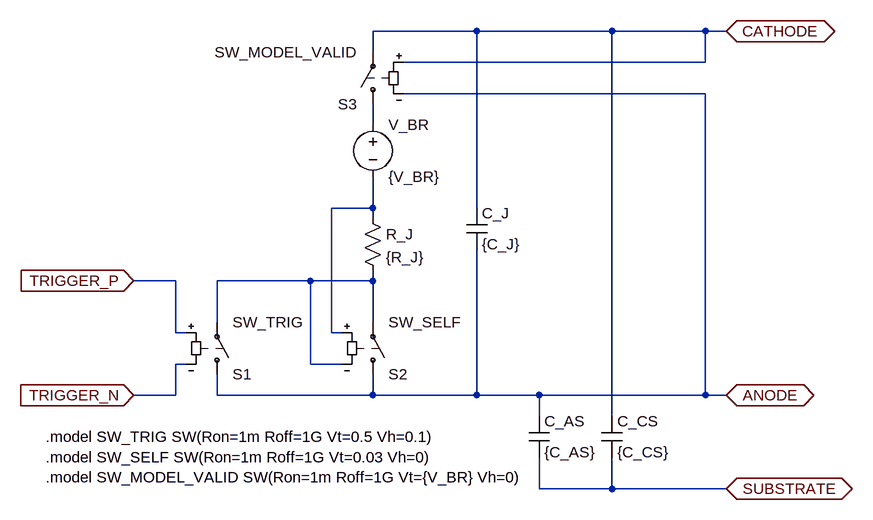
[diagram p0: schematic SPAD_model.asc]
SPAD_model.asc, the LTspice schematic file:
Version 4
SHEET 1 960 680
WIRE -448 -112 -608 -112
WIRE -240 -112 -448 -112
WIRE -96 -112 -240 -112
WIRE -64 -112 -96 -112
WIRE -608 -80 -608 -112
WIRE -96 -64 -96 -112
WIRE -96 -64 -560 -64
WIRE -96 -16 -560 -16
WIRE -608 32 -608 0
WIRE -608 160 -608 112
WIRE -608 160 -672 160
WIRE -448 160 -448 -112
WIRE -608 176 -608 160
WIRE -912 272 -976 272
WIRE -704 272 -848 272
WIRE -608 272 -608 256
WIRE -608 272 -704 272
WIRE -848 336 -848 272
WIRE -608 336 -608 272
WIRE -912 352 -912 272
WIRE -896 352 -912 352
WIRE -672 352 -672 160
WIRE -656 352 -672 352
WIRE -896 400 -912 400
WIRE -704 400 -704 272
WIRE -656 400 -704 400
WIRE -912 448 -912 400
WIRE -912 448 -976 448
WIRE -848 448 -848 416
WIRE -608 448 -608 416
WIRE -608 448 -848 448
WIRE -448 448 -448 224
WIRE -448 448 -608 448
WIRE -352 448 -448 448
WIRE -96 448 -96 -16
WIRE -96 448 -352 448
WIRE -64 448 -96 448
WIRE -352 480 -352 448
WIRE -240 480 -240 -112
WIRE -352 592 -352 544
WIRE -240 592 -240 544
WIRE -240 592 -352 592
WIRE -64 592 -240 592
FLAG -976 272 TRIGGER_P
IOPIN -976 272 In
FLAG -976 448 TRIGGER_N
IOPIN -976 448 In
FLAG -64 448 ANODE
IOPIN -64 448 BiDir
FLAG -64 -112 CATHODE
IOPIN -64 -112 BiDir
FLAG -64 592 SUBSTRATE
IOPIN -64 592 BiDir
SYMBOL voltage -608 16 R0
WINDOW 123 0 0 Left 2
WINDOW 39 0 0 Left 2
SYMATTR InstName V_BR
SYMATTR Value {V_BR}
SYMBOL res -624 160 R0
SYMATTR InstName R_J
SYMATTR Value {R_J}
SYMBOL sw -848 432 M180
SYMATTR InstName S1
SYMATTR Value SW_TRIG
SYMBOL cap -464 160 R0
SYMATTR InstName C_J
SYMATTR Value {C_J}
SYMBOL cap -256 480 R0
SYMATTR InstName C_CS
SYMATTR Value {C_CS}
SYMBOL cap -368 480 R0
SYMATTR InstName C_AS
SYMATTR Value {C_AS}
SYMBOL sw -608 432 M180
SYMATTR InstName S2
SYMATTR Value SW_SELF
SYMBOL sw -608 16 R180
SYMATTR InstName S3
SYMATTR Value SW_MODEL_VALID
TEXT -1112 512 Left 2 !.model SW_TRIG SW(Ron=1m Roff=1G Vt=0.5 Vh=0.1)\n.model SW_SELF SW(Ron=1m Roff=1G Vt=0.03 Vh=0)\n.model SW_MODEL_VALID SW(Ron=1m Roff=1G Vt={V_BR} Vh=0)

The netlist it stands for:
* SPAD_model.asc
V_BR N001 N002 {V_BR}
R_J N002 N003 {R_J}
S1 ANODE N003 TRIGGER_P TRIGGER_N SW_TRIG
C_J CATHODE ANODE {C_J}
C_CS CATHODE SUBSTRATE {C_CS}
C_AS ANODE SUBSTRATE {C_AS}
S2 ANODE N003 N002 N003 SW_SELF
S3 N001 CATHODE CATHODE ANODE SW_MODEL_VALID
.model SW_TRIG SW(Ron=1m Roff=1G Vt=0.5 Vh=0.1)
.model SW_SELF SW(Ron=1m Roff=1G Vt=0.03 Vh=0)
.model SW_MODEL_VALID SW(Ron=1m Roff=1G Vt={V_BR} Vh=0)
.backanno
.end